# Altium schematic sheet LED_1.SchDoc
size A
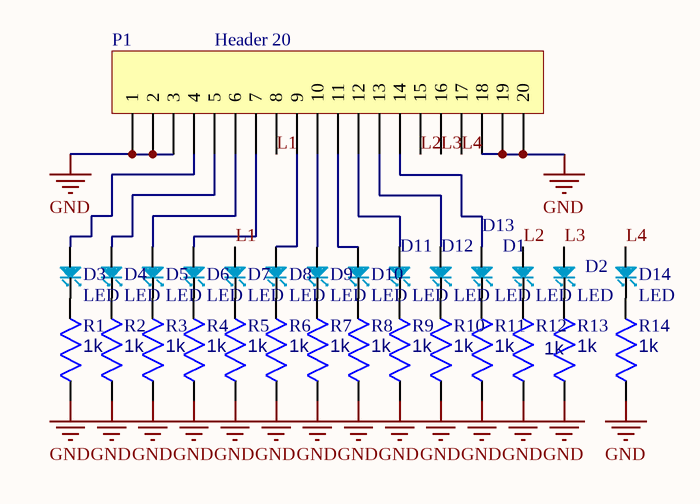
[diagram p0: LED_1.SchDoc]

## Parts
D1  LED  [1206]
D2  LED  [1206]
D3  LED  [1206]
D4  LED  [1206]
D5  LED  [1206]
D6  LED  [1206]
D7  LED  [1206]
D8  LED  [1206]
D9  LED  [1206]
D10  LED  [1206]
D11  LED  [1206]
D12  LED  [1206]
D13  LED  [1206]
D14  LED  [1206]
P1  Header 20  [HDR1X20]
R1  1k  [R_0805]
R2  1k  [R_0805]
R3  1k  [R_0805]
R4  1k  [R_0805]
R5  1k  [R_0805]
R6  1k  [R_0805]
R7  1k  [R_0805]
R8  1k  [R_0805]
R9  1k  [R_0805]
R10  1k  [R_0805]
R11  1k  [R_0805]
R12  1k  [R_0805]
R13  1k  [R_0805]
R14  1k  [R_0805]

## Nets
GND: P1.1 P1.2 P1.3 P1.18 P1.19 P1.20 R1.2 R2.2 R3.2 R4.2 R5.2 R6.2 R7.2 R8.2 R9.2 R10.2 R11.2 R12.2 R13.2 R14.2
L1: D7.1 P1.8
L2: D1.1 P1.15
L3: D2.1 P1.16
L4: D14.1 P1.17
NetD1_2: D1.2 R12.1
NetD2_2: D2.2 R13.1
NetD3_1: D3.1 P1.4
NetD3_2: D3.2 R1.1
NetD4_1: D4.1 P1.5
NetD4_2: D4.2 R2.1
NetD5_1: D5.1 P1.6
NetD5_2: D5.2 R3.1
NetD6_1: D6.1 P1.7
NetD6_2: D6.2 R4.1
NetD7_2: D7.2 R5.1
NetD8_1: D8.1 P1.9
NetD8_2: D8.2 R6.1
NetD9_1: D9.1 P1.10
NetD9_2: D9.2 R7.1
NetD10_1: D10.1 P1.11
NetD10_2: D10.2 R8.1
NetD11_1: D11.1 P1.12
NetD11_2: D11.2 R9.1
NetD12_1: D12.1 P1.13
NetD12_2: D12.2 R10.1
NetD13_1: D13.1 P1.14
NetD13_2: D13.2 R11.1
NetD14_2: D14.2 R14.1

## Library data of the parts
P1 = Header 20: Header, 20-Pin; LatestRevisionDate: 17-Jul-2002; LatestRevisionNote: Re-released for DXP Platform.; Publisher: Altium Limited
R1-R14 = Res 0805: Resistor